# Altium project USB3.2_Hub_4Port.PrjPcb (part 2 of 2)

## Sheet Downstream_Ports_3-4.SchDoc: USB 3.2 Gen 1 4-Port Hub
size 431 x 279 mm; Author: Alberto Marrone; DrawnBy: Alberto Marrone; Engineer: Alberto Marrone; Revision: v1.0; SheetNumber: 7; SheetTotal: 7
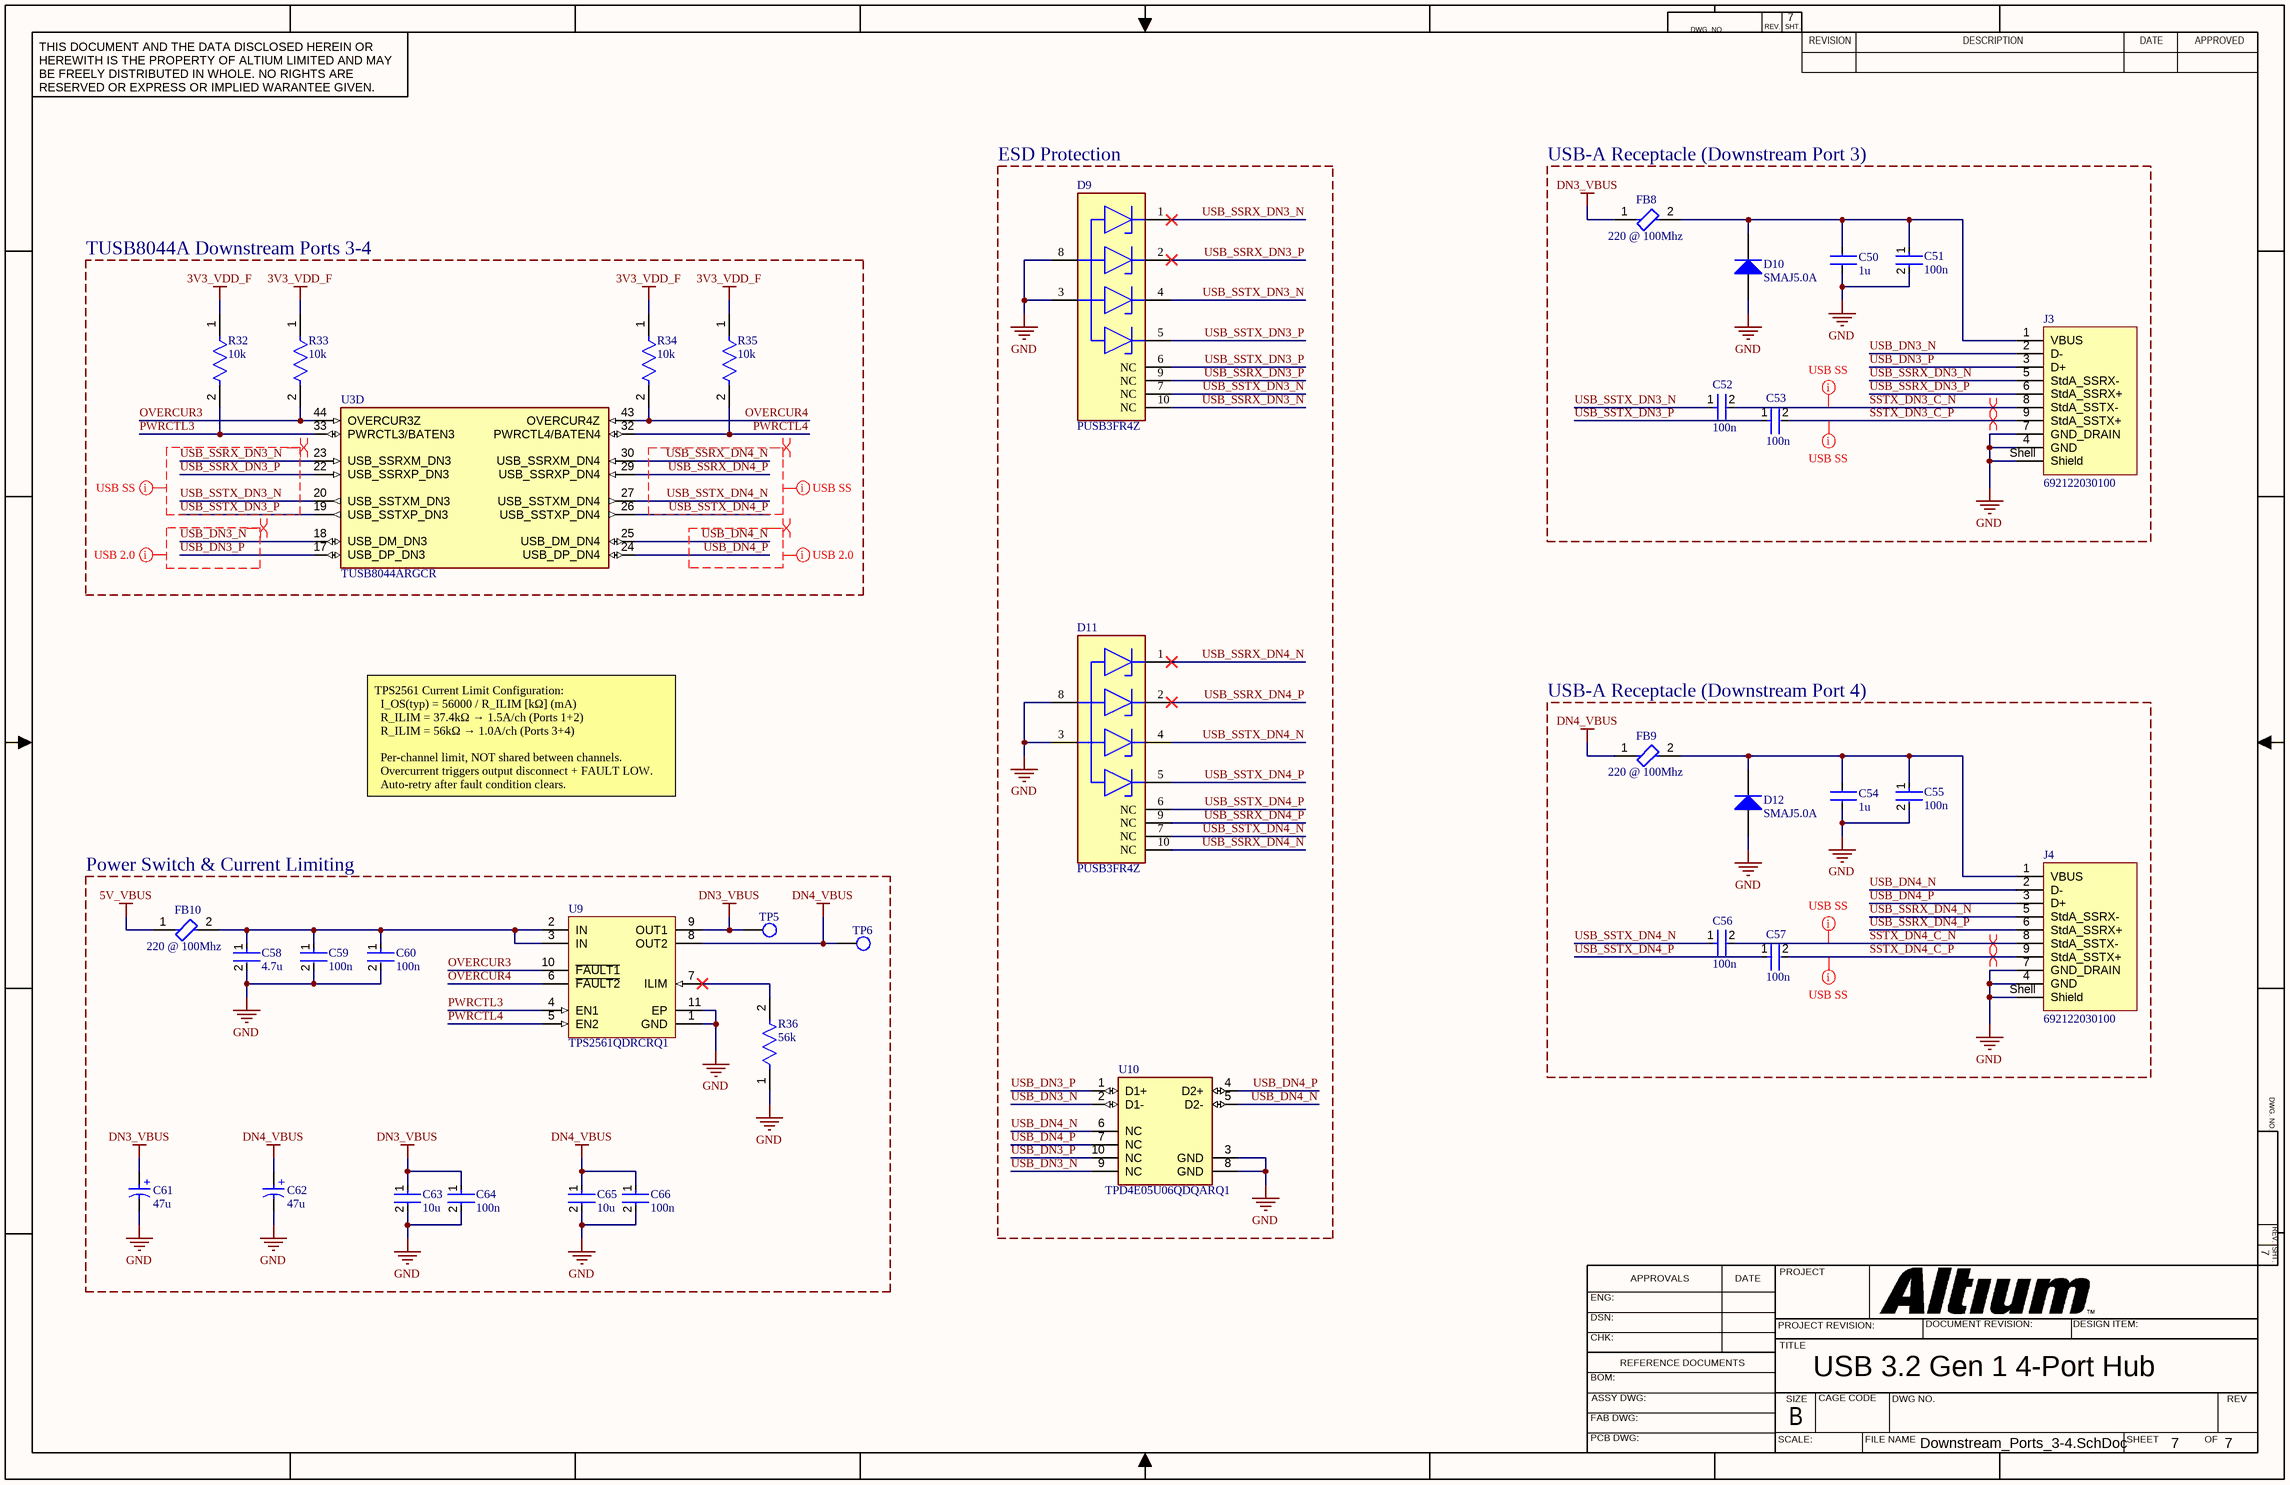
[diagram p5: Downstream_Ports_3-4.SchDoc]

### Parts
C50  1u  [CAPC1608X90N]
C51  100n  [FP-GRT155-0_05-IPC_C]
C52  100n  [FP-GRT155-0_05-IPC_C]
C53  100n  [FP-GRT155-0_05-IPC_C]
C54  1u  [CAPC1608X90N]
C55  100n  [FP-GRT155-0_05-IPC_C]
C56  100n  [FP-GRT155-0_05-IPC_C]
C57  100n  [FP-GRT155-0_05-IPC_C]
C58  4.7u  [FP-GRM21B-0_2-e0_2_0_7-IPC_A]
C59  100n  [FP-GRT155-0_05-IPC_C]
C60  100n  [FP-GRT155-0_05-IPC_C]
C61  47u  [WCAP-ASLL_D6.3H5.5]
C62  47u  [WCAP-ASLL_D6.3H5.5]
C63  10u  [FP-GRM21B-0_2-e0_2_0_7-IPC_B]
C64  100n  [FP-GRT155-0_05-IPC_C]
C65  10u  [FP-GRM21B-0_2-e0_2_0_7-IPC_B]
C66  100n  [FP-GRT155-0_05-IPC_C]
D9  PUSB3FR4Z  [FP-SOT1176-1-MFG]
D10  SMAJ5.0A  [BOUR-SMA-2_V]
D11  PUSB3FR4Z  [FP-SOT1176-1-MFG]
D12  SMAJ5.0A  [BOUR-SMA-2_V]
FB8  220 @ 100Mhz  [FP-BLM21-0_2-t0_85-e0_5-IPC_B]
FB9  220 @ 100Mhz  [FP-BLM21-0_2-t0_85-e0_5-IPC_B]
FB10  220 @ 100Mhz  [FP-BLM21-0_2-t0_85-e0_5-IPC_B]
J3  692122030100  [692122030100]
J4  692122030100  [692122030100]
R32  10k  [FP-AC0402-MFG]
R33  10k  [FP-AC0402-MFG]
R34  10k  [FP-AC0402-MFG]
R35  10k  [FP-AC0402-MFG]
R36  56k  [FP-AC0402-IPC_A]
TP5  Test_Point  [Test_Point]  (value not drawn)  (no BOM)
TP6  Test_Point  [Test_Point]  (value not drawn)  (no BOM)
U3  TUSB8044ARGCR  [QFN50P900X900X100-65N-D]  (part D of 6)
U9  TPS2561QDRCRQ1  [DRC0010A_V]
U10  TPD4E05U06QDQARQ1  [FP-DQA0010A-MFG]

### Blocks framed on the sheet
ESD Protection: D9 D11 U10
USB-A Receptacle (Downstream Port 3): C50-C53 D10 FB8 J3
TUSB8044A Downstream Ports 3-4: R32-R35 U3
USB-A Receptacle (Downstream Port 4): C54-C57 D12 FB9 J4
Power Switch & Current Limiting: C58-C66 FB10 R36 TP5 TP6 U9

### Nets
3V3_VDD_F: R32.1 R33.1 R34.1 R35.1
5V_VBUS: FB10.1
DN3_VBUS: C61.1(P) C63.1 C64.1 FB8.1 TP5.1 U9.9(OUT1)
DN4_VBUS: C62.1(P) C65.1 C66.1 FB9.1 TP6.1 U9.8(OUT2)
GND: C50.1 C51.2 C54.1 C55.2 C58.2 C59.2 C60.2 C61.2(N) C62.2(N) C63.2 C64.2 C65.2 C66.2 D9.3(GND) D9.8(GND) D10.1(A) D11.3(GND) D11.8(GND) D12.1(A) J3.4(GND) J3.7(GND_DRAIN) J3.Shell(Shield) J4.4(GND) J4.7(GND_DRAIN) J4.Shell(Shield) R36.1 U9.1(GND) U9.11(EP) U10.3(GND) U10.8(GND)
OVERCUR3: R33.2 U3.44(OVERCUR3Z) U9.10(~{FAULT1})
OVERCUR4: R34.2 U3.43(OVERCUR4Z) U9.6(~{FAULT2})
PWRCTL3: R32.2 U3.33(PWRCTL3/BATEN3) U9.4(EN1)
PWRCTL4: R35.2 U3.32(PWRCTL4/BATEN4) U9.5(EN2)
SSTX_DN3_C_N: C52.2 J3.8(StdA_SSTX-)
SSTX_DN3_C_P: C53.2 J3.9(StdA_SSTX+)
SSTX_DN4_C_N: C56.2 J4.8(StdA_SSTX-)
SSTX_DN4_C_P: C57.2 J4.9(StdA_SSTX+)
USB_DN3_N: J3.2(D-) U3.18(USB_DM_DN3) U10.2(D1-) U10.9(NC)
USB_DN3_P: J3.3(D+) U3.17(USB_DP_DN3) U10.1(D1+) U10.10(NC)
USB_DN4_N: J4.2(D-) U3.25(USB_DM_DN4) U10.5(D2-) U10.6(NC)
USB_DN4_P: J4.3(D+) U3.24(USB_DP_DN4) U10.4(D2+) U10.7(NC)
USB_SSRX_DN3_N: D9.1(CH1) D9.10(NC) J3.5(StdA_SSRX-) U3.23(USB_SSRXM_DN3)
USB_SSRX_DN3_P: D9.2(CH2) D9.9(NC) J3.6(StdA_SSRX+) U3.22(USB_SSRXP_DN3)
USB_SSRX_DN4_N: D11.1(CH1) D11.10(NC) J4.5(StdA_SSRX-) U3.30(USB_SSRXM_DN4)
USB_SSRX_DN4_P: D11.2(CH2) D11.9(NC) J4.6(StdA_SSRX+) U3.29(USB_SSRXP_DN4)
USB_SSTX_DN3_N: C52.1 D9.4(CH3) D9.7(NC) U3.20(USB_SSTXM_DN3)
USB_SSTX_DN3_P: C53.1 D9.5(CH4) D9.6(NC) U3.19(USB_SSTXP_DN3)
USB_SSTX_DN4_N: C56.1 D11.4(CH3) D11.7(NC) U3.27(USB_SSTXM_DN4)
USB_SSTX_DN4_P: C57.1 D11.5(CH4) D11.6(NC) U3.26(USB_SSTXP_DN4)
NetC50_2: C50.2 C51.1 D10.2(K) FB8.2 J3.1(VBUS)
NetC54_2: C54.2 C55.1 D12.2(K) FB9.2 J4.1(VBUS)
NetC58_1: C58.1 C59.1 C60.1 FB10.2 U9.2(IN) U9.3(IN)
NetR36_2: R36.2 U9.7(ILIM)

### Layout directives
differential pair: SSTX_DN3_C_N, SSTX_DN3_C_P, SSTX_DN4_C_N, SSTX_DN4_C_P, USB_DN3_N, USB_DN3_P, USB_DN4_N, USB_DN4_P, USB_SSRX_DN3_N, USB_SSRX_DN3_P, USB_SSRX_DN4_N, USB_SSRX_DN4_P, USB_SSTX_DN3_N, USB_SSTX_DN3_P, USB_SSTX_DN4_N, USB_SSTX_DN4_P
net class USB_SuperSpeed: SSTX_DN3_C_N, SSTX_DN3_C_P, SSTX_DN4_C_N, SSTX_DN4_C_P, USB_SSRX_DN3_N, USB_SSRX_DN3_P, USB_SSRX_DN4_N, USB_SSRX_DN4_P, USB_SSTX_DN3_N, USB_SSTX_DN3_P, USB_SSTX_DN4_N, USB_SSTX_DN4_P
net class USB_HighSpeed: USB_DN3_N, USB_DN3_P, USB_DN4_N, USB_DN4_P

### Notes on the sheet
- TPS2561 Current Limit Configuration:
  I_OS(typ) = 56000 / R_ILIM [kΩ] (mA)
  R_ILIM = 37.4kΩ → 1.5A/ch (Ports 1+2)
  R_ILIM = 56kΩ → 1.0A/ch (Ports 3+4)
  Per-channel limit, NOT shared between channels.
  Overcurrent triggers output disconnect + FAULT LOW.
  Auto-retry after fault condition clears.
- DWG. NO.
- REV.
- SHT.
- THIS DOCUMENT AND THE DATA DISCLOSED HEREIN OR HEREWITH IS THE PROPERTY OF ALTIUM LIMITED AND MAY BE FREELY DISTRIBUTED IN WHOLE. NO RIGHTS ARE RESERVED OR EXPRESS OR IMPLIED WARANTEE GIVEN.
- REVISION
- DESCRIPTION
- DATE
- APPROVED
- ENG:
- APPROVALS
- PROJECT
- DSN:
- CHK:
- REFERENCE DOCUMENTS
- PROJECT REVISION:
- TITLE
- DOCUMENT REVISION:
- DESIGN ITEM:
- BOM:
- FAB DWG:
- PCB DWG:
- ASSY DWG:
- SCALE:
- SIZE
- B
- CAGE CODE
- FILE NAME
- DWG NO.
- SHEET
- OF
- REV
- (in symbol CMP-03913-53914523-3) +

### Library data of the parts
C50 C54 = C1608X7R1H105K080AB: The superior mechanical strength and reliability due to the monolithic structure.  Low ESR, ESL and excellent frequency characteristics allow for a circuit design that closely conforms to theoretical values.  Low self-heating and high ripple resistance due to low ESR.  No polarity; Manufacturer_Name: TDK; Geometry.Height: 0.9mm; Mouser Part Number: 810-C1608X7R1H105K08; Mouser Price/Stock: https://www.mouser.co.uk/ProductDetail/TDK/C1608X7R1H105K080AB?qs=efUn273yAhdzCWVW9RXgig%3D%3D; Manufacturer_Part_Number: C1608X7R1H105K080AB; Datasheet Link: https://media.digikey.com/pdf/Data%20Sheets/TDK%20PDFs/mlcc_commercial_general_Rev2018.pdf
C51-C53 C55-C57 C59 C60 C64 C66 = CMP-06035-030480-1: Multi-Layer Ceramic Capacitor 100nF 50V X7R ±10% 0402 Paper T/R
C58 = CMP-06035-048385-1: Chip Multilayer Ceramic Capacitors for General Purpose, 0805, 4.7uF, X7R, 15%, 10%, 35V
C61 C62 = CMP-03913-53914523-3: Alum. Electrolytic Cap 47UF 35V 5.5MMV-CHIP Wcap-asll, Lifetime 2000H +105OC; Insulation Resistance: 2.12766MΩ; Capacitance: 47µF; Life (Hours): 2000hours; Material: Aluminium; ESR (Equivalent Series Resistance): 416.365mΩ; Leakage Current: 16.45µA; Ripple Current (AC): 240mA; Tolerance: 20%; Impedance: 440mΩ; Min Operating Temperature: -55°C; Length: 5.5mm; Voltage Rating (DC): 35V; REACH SVHC: Unknown; Height: 5.5mm; Max Operating Temperature: 105°C; Diameter: 6.3mm; Voltage Rating: 35V; Case/Package: Radial; Packaging: Cut Tape; Ripple Current: 240mA
C63 C65 = CMP-06035-047417-1: Chip Multilayer Ceramic Capacitors for General Purpose, 0805, 10uF, X7R, 15%, 10%, 25V
D9 D11 = CMP-14432-000005-1: TVS DIODE 3.3VWM 3VC DFN2510A-10; RoHS Compliant: Yes
D10 D12 = CMP-2000-07090-1: SMAJ Transient Voltage Suppressor Diode Series, 3.5 V, -55 to 150 degC, 2-Pin SMA, RoHS, Tape and Reel; Manufacturer: Bourns; EDA / CAD Models: DownloadfromAcceleratedDesigns; Unidirectional Channels: 1; Voltage - Breakdown (Min): 6.4V; Voltage - Reverse Standoff (Typ): 5V; Voltage - Clamping (Max) @ Ipp: 9.2V; Other Names: SMAJ5.0ABDKR; Type: Zener; Catalog Drawings: SMAJSeriesFootprintSMAJ,SMBJSeries; Featured Product: SMAJ/SMBJ/SMCJ/SMLJDiscreteTVSDiodes; Power - Peak Pulse: 400W; Current - Peak Pulse (10/1000µs): 43.5A; Power Line Protection: No; Online Catalog: SMAJSeries; Supplier Device Package: SMA(DO-214AC); Operating Temperature: -55°C~150°C(TJ); Package Description: 2-Pin Surface Mount Device, Body 4.315 x 2.605 mm; Datasheet URL: https://datasheet.ciiva.com/25624/0900766b8112213b-25624680.pdf; Manufacturer URL: http://www.bourns.com/; Datasheet Version: 08/2012; Series: SMAJ; Family: TVS-Diodes; Bidirectional Channels: -; Applications: GeneralPurpose; Package Reference: SMA-2; Standard Package: 1; Package / Case: DO-214AC,SMA; Category: CircuitProtection; RoHS Information: SMAJSeriesMaterialDeclaration; Mounting Technology: SurfaceMount; Capacitance @ Frequency: -; Packaging: Digi-Reel®; Mounting Type: SurfaceMount
FB8-FB10 = CMP-0686-00610-3: Chip Ferrite Bead, 0805, 220Ω @ 100MHz, 0.045Ω, 25%, 2A; Number of Circuits: 1; Shielding: Unshielded; DC Resistance (DCR): 45mR; Impedance: 220R; Radiation Hardening: No; Material: Ferrite; Frequency: 100MHz; Width: 1.25mm; DC Current: 2A; Max DC Current: 2A; Number of Lines: 1; Package Quantity: 1; Case Code (Metric): 2012; Current Rating: 2A; Case/Package: 0805; Current: 2A; Military Standard: Not; Core Material: Ferrite; Depth: 1.25mm; Contact Plating: Tin; DC Resistance-Max: 45mR; Max Operating Temperature: 125°C; Length: 2mm; Max Current Rating: 2A; REACH SVHC: No SVHC; Termination: SMD/SMT; Min Operating Temperature: -55°C; Series: BLM21P; Test Frequency: 100MHz; Tolerance: 25%; Number of Pins: 2; RoHS Compliant: Yes; Height: 0.85mm; Packaging: Tape and Reel; Lead Free: Lead Free; Case Code (Imperial): 0805
J3 J4 = CMP-1502-03220-3: Conn USB 3.0 Type A RCP 9 POS 1.25mm Solder RA SMD 9 Terminal 1 Port T/R; Current Rating: 250mA; Insulation Resistance: 100MΩ; Number of Contacts: 9; Number of Ports: 1; Voltage Rating (AC): 30V; USB Standard: USB 3.0; Gender: Receptacle; Contact Resistance: 50mΩ; RoHS: Compliant; Min Operating Temperature: -20°C; Packaging: Tape and Reel; Width: 16.66mm; Contact Plating: Gold; Color: Blue; Height: 8.01mm; Mount: Horizontal, Surface Mount, Through Hole; Voltage Rating: 30V; Contact Material: Gold, Nickel; Connector Type: USB; REACH SVHC: Unknown; Number of Pins: 9; Max Operating Temperature: 85°C; Operating Supply Voltage: 30V; Lead Free: Lead Free; Termination: SMD/SMT; Orientation: Horizontal; Flammability Rating: UL94 V-0; Features: Shielded; Length: 15.1mm
R32-R35 = CMP-2002-01790-3: RES 10kΩ ±1% 0.063W 0402; Power Rating: 62.5mW; Voltage Rating: 50V; Temperature Coefficient: 100ppm/°C; Resistance: 10kR; Max Power Dissipation: 63mW; Tolerance: 1%; Military Standard: Not; Construction: Rectangular; Termination: SMD/SMT; Max Operating Temperature: 155°C; Min Operating Temperature: -55°C; Height: 0.015inch; Lead Free: Lead Free; Width: 0.02inch; Case/Package: 0402; Resistor Type: Thick Film; Series: AC; Features: Moisture Resistant; RoHS Compliant: Yes; Number of Terminations: 2; Case Code (Metric): 1005; Length: 0.039inch; Depth: 0.5mm; Size Code: 0402; Packaging: Tape and Reel; Case Code (Imperial): 0402
R36 = CMP-2002-01828-3: RES 56kΩ ±1% 0.063W 0402; Max Power Dissipation: 63mW; Temperature Coefficient: 100ppm/°C; Resistance: 56kR; Lead Free: Lead Free; Max Operating Temperature: 155°C; Series: AC; Case Code (Imperial): 0402; RoHS Compliant: Yes; Case/Package: 0402; Power Rating: 63mW; Height: 0.015inch; Tolerance: 1%; Features: Moisture Resistant; Size Code: 0402; Min Operating Temperature: -55°C; Resistor Type: Thick Film; Case Code (Metric): 1005; Length: 0.039inch; Number of Terminations: 2; Width: 0.02inch; Packaging: Cut Tape
U3 = TUSB8044ARGCR: Four-port USB 3.2 x1 Gen1 hub with USB billboard; Manufacturer_Name: Texas Instruments; Geometry.Height: 1mm; Mouser Part Number: 595-TUSB8044ARGCR; Mouser Price/Stock: https://www.mouser.co.uk/ProductDetail/Texas-Instruments/TUSB8044ARGCR?qs=9r4v7xj2LnlTBCFutY1Bfg%3D%3D; Manufacturer_Part_Number: TUSB8044ARGCR; Datasheet Link: http://www.ti.com/lit/gpn/TUSB8044A
U9 = CMP-0337-00206-2: Automotive Catalog Dual Channel Precision Adjustable Current-Limited Power Switch, 0.25 to 2.5 A Current Limit, -40 to 125 degC, 10-pin SON (DRC), Green (RoHS & no Sb/Br); Manufacturer: Texas Instruments; rDS(on) per FET(Typ)(mOhms): 45; Current Limit(A): 0.25 - 2.5; Current Limit Accuracy @ 1A: +/-7.5% (2590mA min / 3005mA max); Vin(Min)(V): 2.5; Number of Switches: 2; Vin(Max)(V): 6.5; Current Limit Topology: Constant-Current; Enable: Active High; DatasheetVersion: SLVSB51A; Eco-Plan: Green (RoHS & no Sb/Br); PartNumber: TPS2561QDRCRQ1; PackageReference: DRC0010A; Rating: Automotive; PackageDescription: 10-Pin Plastic Small Outline No-Lead, 3 x 3 x 1 mm Body, 0.5 mm Pitch, Exposed Pad; Continuous Current(Max)(A): 2.5; Mounting Technology: Surface Mount; PackageVersion: revL, Sep-2011; ComponentLink1Description: Datasheet; ComponentLink1URL: http://www.ti.com/general/docs/lit/getliterature.tsp?genericPartNumber=TPS2561-Q1&fileType=pdf
U10 = CMP-04985-000004-1: TVS DIODE 5.5V 14V 10USON; Manufacturer: Texas Instruments; Direction: Unidirectional; Standoff Height: 0mm; Capacitance: 0.5pF; Number Of Channels: 4; Breakdown Voltage: 6.4V; Peak Pulse Power: 2.5W; Automotive Grade: Grade 1; Value: 0.5pF; Interface: USB,Ethernet,LVDS,Other; Peak Pulse Current: 2.5A; Operating Supply Voltage: 5.5V; Reverse Standoff Voltage: 5.5V; Package: DQA0010A; Temperature Range Low: -40°C; Temperature Range High: +125°C; Ambient Temperature Range Low: -40°C; Device Class L1: Circuit Protection; Clamping Voltage: 14V; Manufacturer Part Number: TPD4E05U06QDQARQ1; Device Class L2: ESD and Circuit Protection ICs; Octopart: https://octopart.com/tpd4e05u06qdqarq1-texas+instruments-48523459; Device Class L3: unset; Height: 0.55mm; Automotive: Yes; ComponentLink2Description: Datasheet; RoHS: TRUE; Ambient Temperature Range High: +125°C; Category: IC; Mouser Description: Automotive 4-Channel ESD Protection Solution for SuperSpeed (up to 5 Gbps) Interface 10-USON -40 to 125; Temperature: -40°C to +125°C; ComponentLink2URL: http://www.ti.com/lit/ds/symlink/tpd4e05u06-q1.pdf; Digikey Description: TVS DIODE 5.5V 14V 10USON; Lead Free: Yes

## Sheet Downstream_Port_2.SchDoc: USB 3.2 Gen 1 4-Port Hub
size 431 x 279 mm; Author: Alberto Marrone; DrawnBy: Alberto Marrone; Engineer: Alberto Marrone; Revision: v1.0; SheetNumber: 6; SheetTotal: 7
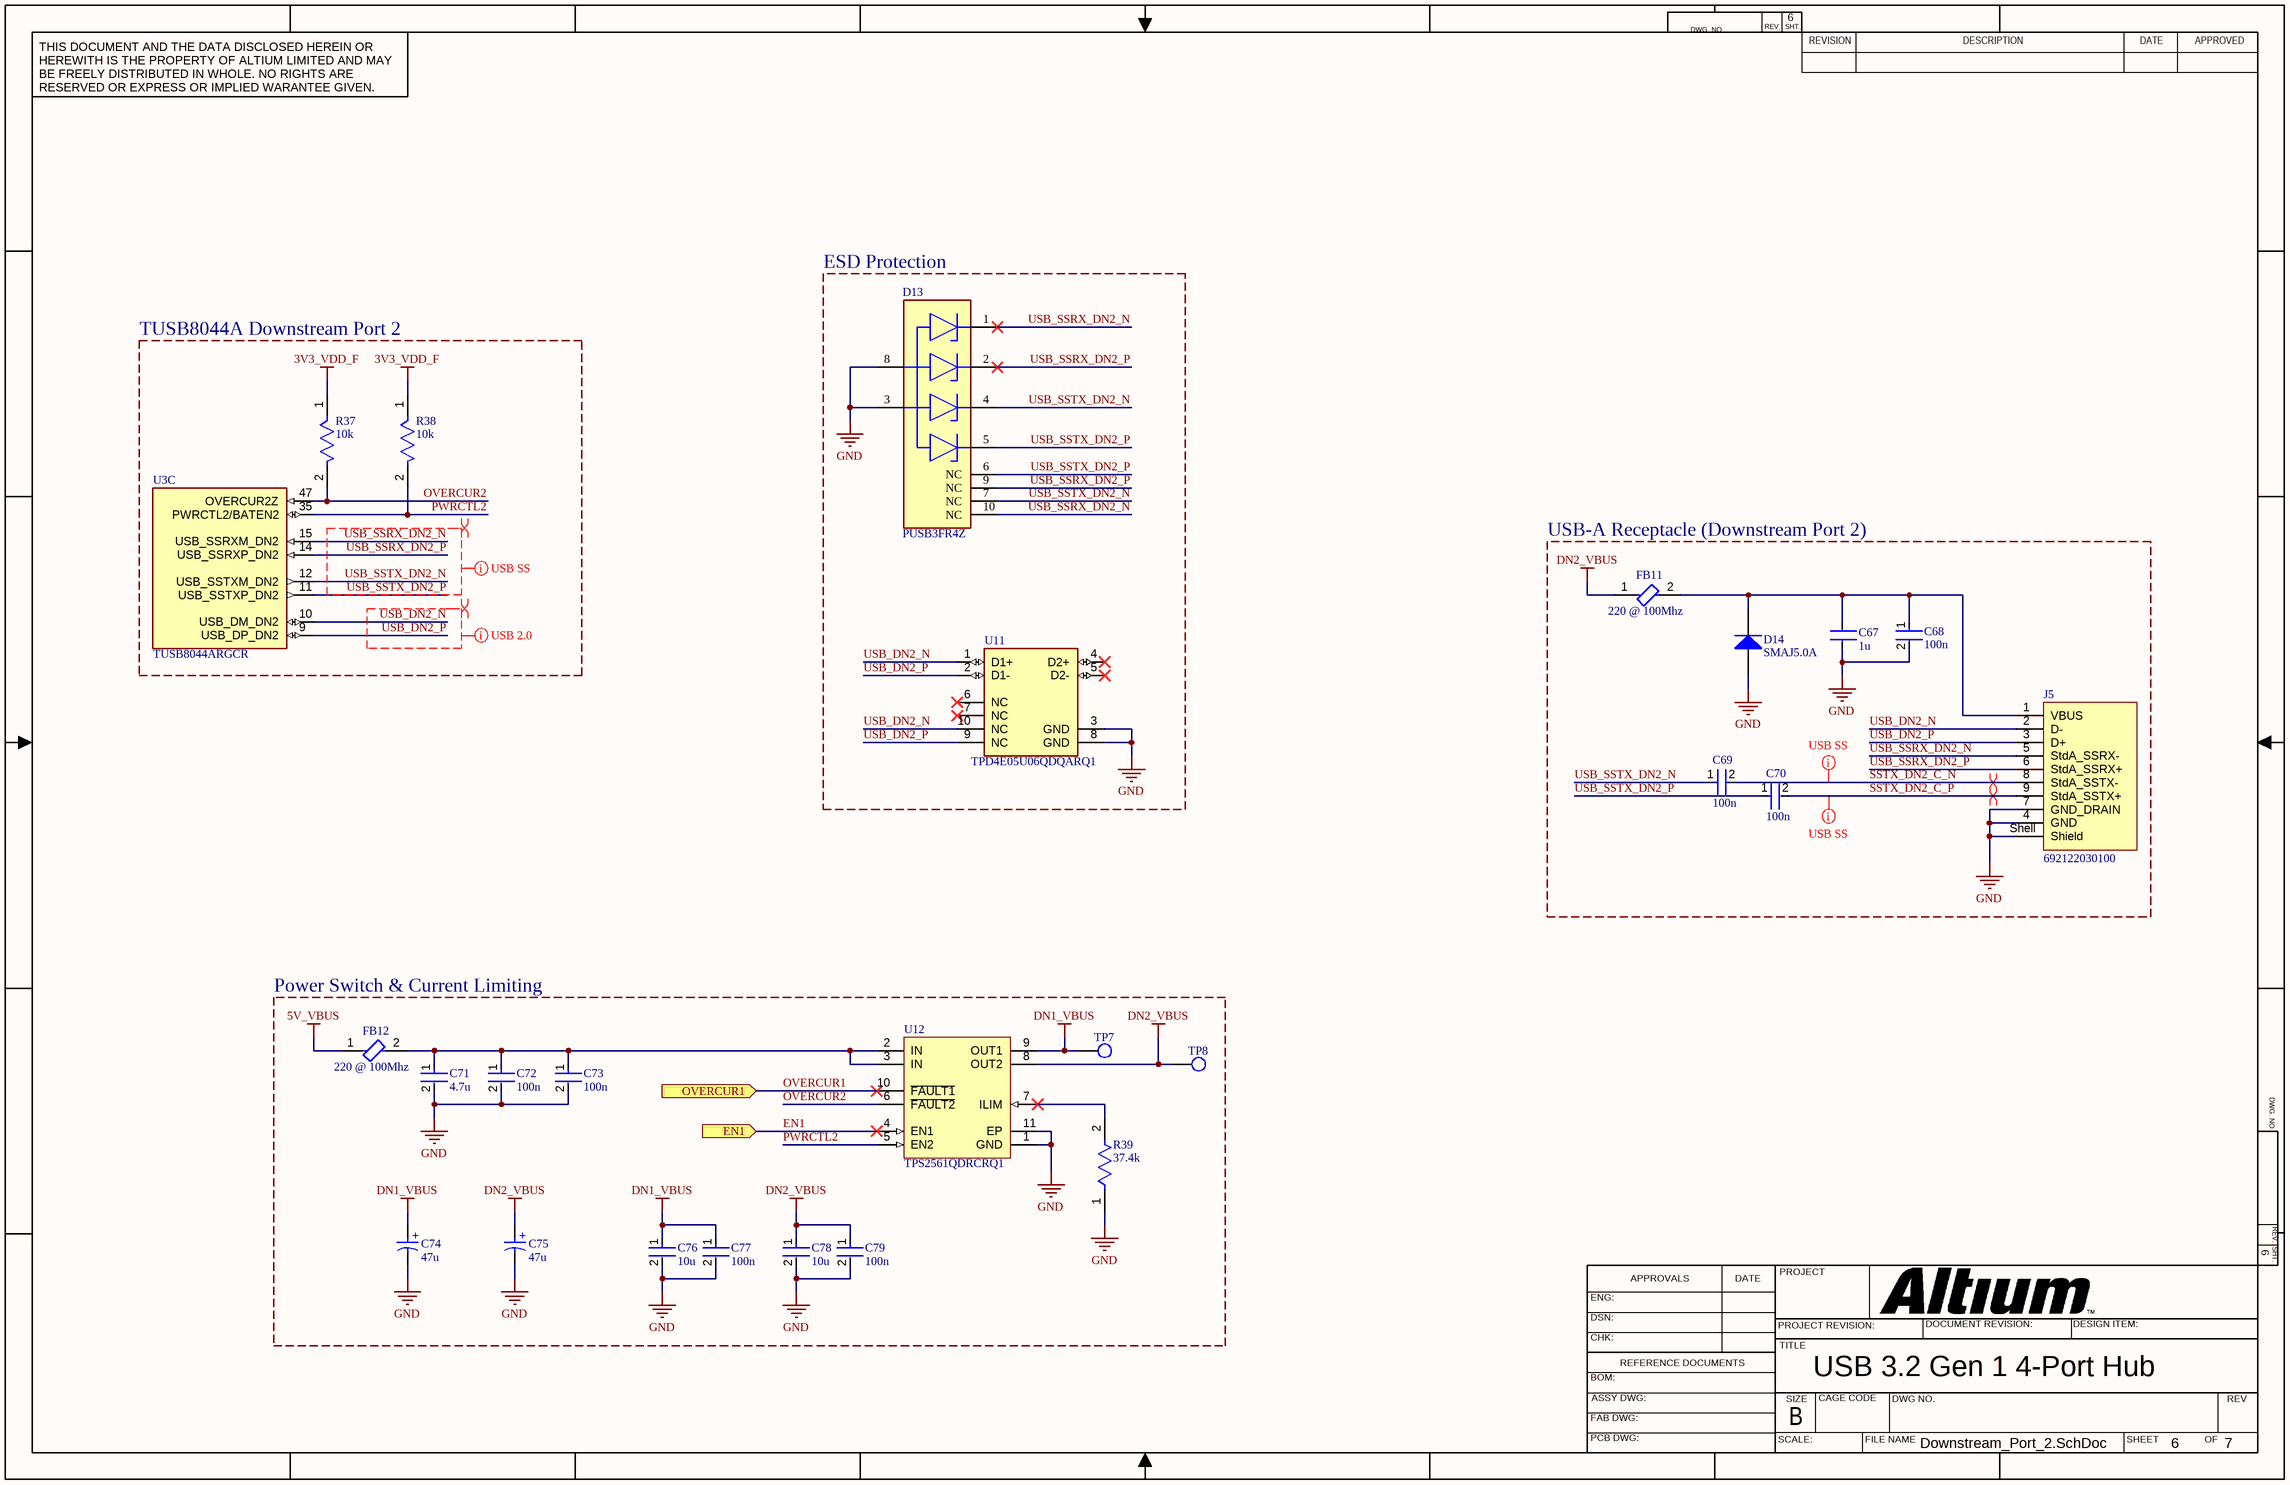
[diagram p6: Downstream_Port_2.SchDoc]

### Parts
C67  1u  [CAPC1608X90N]
C68  100n  [FP-GRT155-0_05-IPC_C]
C69  100n  [FP-GRT155-0_05-IPC_C]
C70  100n  [FP-GRT155-0_05-IPC_C]
C71  4.7u  [FP-GRM21B-0_2-e0_2_0_7-IPC_A]
C72  100n  [FP-GRT155-0_05-IPC_C]
C73  100n  [FP-GRT155-0_05-IPC_C]
C74  47u  [WCAP-ASLL_D6.3H5.5]
C75  47u  [WCAP-ASLL_D6.3H5.5]
C76  10u  [FP-GRM21B-0_2-e0_2_0_7-IPC_B]
C77  100n  [FP-GRT155-0_05-IPC_C]
C78  10u  [FP-GRM21B-0_2-e0_2_0_7-IPC_B]
C79  100n  [FP-GRT155-0_05-IPC_C]
D13  PUSB3FR4Z  [FP-SOT1176-1-MFG]
D14  SMAJ5.0A  [BOUR-SMA-2_V]
FB11  220 @ 100Mhz  [FP-BLM21-0_2-t0_85-e0_5-IPC_B]
FB12  220 @ 100Mhz  [FP-BLM21-0_2-t0_85-e0_5-IPC_B]
J5  692122030100  [692122030100]
R37  10k  [FP-AC0402-MFG]
R38  10k  [FP-AC0402-MFG]
R39  37.4k  [FP-AC0402-IPC_B]
TP7  Test_Point  [Test_Point]  (value not drawn)  (no BOM)
TP8  Test_Point  [Test_Point]  (value not drawn)  (no BOM)
U3  TUSB8044ARGCR  [QFN50P900X900X100-65N-D]  (part C of 6)
U11  TPD4E05U06QDQARQ1  [FP-DQA0010A-MFG]
U12  TPS2561QDRCRQ1  [DRC0010A_V]

### Blocks framed on the sheet
ESD Protection: D13 U11
TUSB8044A Downstream Port 2: R37 R38 U3
USB-A Receptacle (Downstream Port 2): C67-C70 D14 FB11 J5
Power Switch & Current Limiting: C71-C79 FB12 R39 TP7 TP8 U12

### Ports
EN1 (in, see Top_Level[4D], Downstream_Port_1[5B]), OVERCUR1 (in, see Top_Level[3D], Downstream_Port_1[7B])

### Nets
3V3_VDD_F: R37.1 R38.1
5V_VBUS: FB12.1
DN1_VBUS: C74.1(P) C76.1 C77.1 TP7.1 U12.9(OUT1)
DN2_VBUS: C75.1(P) C78.1 C79.1 FB11.1 TP8.1 U12.8(OUT2)
GND: C67.1 C68.2 C71.2 C72.2 C73.2 C74.2(N) C75.2(N) C76.2 C77.2 C78.2 C79.2 D13.3(GND) D13.8(GND) D14.1(A) J5.4(GND) J5.7(GND_DRAIN) J5.Shell(Shield) R39.1 U11.3(GND) U11.8(GND) U12.1(GND) U12.11(EP)
EN1: U12.4(EN1) ; port EN1
OVERCUR1: U12.10(~{FAULT1}) ; port OVERCUR1
OVERCUR2: R37.2 U3.47(OVERCUR2Z) U12.6(~{FAULT2})
PWRCTL2: R38.2 U3.35(PWRCTL2/BATEN2) U12.5(EN2)
SSTX_DN2_C_N: C69.2 J5.8(StdA_SSTX-)
SSTX_DN2_C_P: C70.2 J5.9(StdA_SSTX+)
USB_DN2_N: J5.2(D-) U3.10(USB_DM_DN2) U11.1(D1+) U11.10(NC)
USB_DN2_P: J5.3(D+) U3.9(USB_DP_DN2) U11.2(D1-) U11.9(NC)
USB_SSRX_DN2_N: D13.1(CH1) D13.10(NC) J5.5(StdA_SSRX-) U3.15(USB_SSRXM_DN2)
USB_SSRX_DN2_P: D13.2(CH2) D13.9(NC) J5.6(StdA_SSRX+) U3.14(USB_SSRXP_DN2)
USB_SSTX_DN2_N: C69.1 D13.4(CH3) D13.7(NC) U3.12(USB_SSTXM_DN2)
USB_SSTX_DN2_P: C70.1 D13.5(CH4) D13.6(NC) U3.11(USB_SSTXP_DN2)
NetC67_2: C67.2 C68.1 D14.2(K) FB11.2 J5.1(VBUS)
NetC71_1: C71.1 C72.1 C73.1 FB12.2 U12.2(IN) U12.3(IN)
NetR39_2: R39.2 U12.7(ILIM)

Not connected (* = marked no-connect by the designer): U11 4(D2+)* 5(D2-)* 6(NC)* 7(NC)*

### Layout directives
differential pair: SSTX_DN2_C_N, SSTX_DN2_C_P, USB_DN2_N, USB_DN2_P, USB_SSRX_DN2_N, USB_SSRX_DN2_P, USB_SSTX_DN2_N, USB_SSTX_DN2_P
net class USB_SuperSpeed: SSTX_DN2_C_N, SSTX_DN2_C_P, USB_SSRX_DN2_N, USB_SSRX_DN2_P, USB_SSTX_DN2_N, USB_SSTX_DN2_P
net class USB_HighSpeed: USB_DN2_N, USB_DN2_P

### Notes on the sheet
- DWG. NO.
- REV.
- SHT.
- THIS DOCUMENT AND THE DATA DISCLOSED HEREIN OR HEREWITH IS THE PROPERTY OF ALTIUM LIMITED AND MAY BE FREELY DISTRIBUTED IN WHOLE. NO RIGHTS ARE RESERVED OR EXPRESS OR IMPLIED WARANTEE GIVEN.
- REVISION
- DESCRIPTION
- DATE
- APPROVED
- ENG:
- APPROVALS
- PROJECT
- DSN:
- CHK:
- REFERENCE DOCUMENTS
- PROJECT REVISION:
- TITLE
- DOCUMENT REVISION:
- DESIGN ITEM:
- BOM:
- FAB DWG:
- PCB DWG:
- ASSY DWG:
- SCALE:
- SIZE
- B
- CAGE CODE
- FILE NAME
- DWG NO.
- SHEET
- OF
- REV
- (in symbol CMP-03913-53914523-3) +

### Library data of the parts
C67 = C1608X7R1H105K080AB: as C50 on sheet Downstream_Ports_3-4; Mouser Part Number: 810-C1608X7R1H105K08; Mouser Price/Stock: https://www.mouser.co.uk/ProductDetail/TDK/C1608X7R1H105K080AB?qs=efUn273yAhdzCWVW9RXgig%3D%3D; Manufacturer_Part_Number: C1608X7R1H105K080AB; Datasheet Link: https://media.digikey.com/pdf/Data%20Sheets/TDK%20PDFs/mlcc_commercial_general_Rev2018.pdf
C68-C70 C72 C73 C77 C79 = CMP-06035-030480-1: as C51 on sheet Downstream_Ports_3-4
C71 = CMP-06035-048385-1: as C58 on sheet Downstream_Ports_3-4
C74 C75 = CMP-03913-53914523-3: as C61 on sheet Downstream_Ports_3-4; Min Operating Temperature: -55°C; Length: 5.5mm; Voltage Rating (DC): 35V; REACH SVHC: Unknown; Height: 5.5mm; Max Operating Temperature: 105°C; Diameter: 6.3mm; Voltage Rating: 35V; Case/Package: Radial; Packaging: Cut Tape; Ripple Current: 240mA
C76 C78 = CMP-06035-047417-1: as C63 on sheet Downstream_Ports_3-4
D13 = CMP-14432-000005-1: TVS DIODE 3.3VWM 3VC DFN2510A-10; RoHS Compliant: Yes
D14 = CMP-2000-07090-1: as D10 on sheet Downstream_Ports_3-4; Supplier Device Package: SMA(DO-214AC); Operating Temperature: -55°C~150°C(TJ); Package Description: 2-Pin Surface Mount Device, Body 4.315 x 2.605 mm; Datasheet URL: https://datasheet.ciiva.com/25624/0900766b8112213b-25624680.pdf; Manufacturer URL: http://www.bourns.com/; Datasheet Version: 08/2012; Series: SMAJ; Family: TVS-Diodes; Bidirectional Channels: -; Applications: GeneralPurpose; Package Reference: SMA-2; Standard Package: 1; Package / Case: DO-214AC,SMA; Category: CircuitProtection; RoHS Information: SMAJSeriesMaterialDeclaration; Mounting Technology: SurfaceMount; Capacitance @ Frequency: -; Packaging: Digi-Reel®; Mounting Type: SurfaceMount
FB11 FB12 = CMP-0686-00610-3: as FB8 on sheet Downstream_Ports_3-4; Radiation Hardening: No; Material: Ferrite; Frequency: 100MHz; Width: 1.25mm; DC Current: 2A; Max DC Current: 2A; Number of Lines: 1; Package Quantity: 1; Case Code (Metric): 2012; Current Rating: 2A; Case/Package: 0805; Current: 2A; Military Standard: Not; Core Material: Ferrite; Depth: 1.25mm; Contact Plating: Tin; DC Resistance-Max: 45mR; Max Operating Temperature: 125°C; Length: 2mm; Max Current Rating: 2A; REACH SVHC: No SVHC; Termination: SMD/SMT; Min Operating Temperature: -55°C; Series: BLM21P; Test Frequency: 100MHz; Tolerance: 25%; Number of Pins: 2; RoHS Compliant: Yes; Height: 0.85mm; Packaging: Tape and Reel; Lead Free: Lead Free; Case Code (Imperial): 0805
J5 = CMP-1502-03220-3: as J3 on sheet Downstream_Ports_3-4; RoHS: Compliant; Min Operating Temperature: -20°C; Packaging: Tape and Reel; Width: 16.66mm; Contact Plating: Gold; Color: Blue; Height: 8.01mm; Mount: Horizontal, Surface Mount, Through Hole; Voltage Rating: 30V; Contact Material: Gold, Nickel; Connector Type: USB; REACH SVHC: Unknown; Number of Pins: 9; Max Operating Temperature: 85°C; Operating Supply Voltage: 30V; Lead Free: Lead Free; Termination: SMD/SMT; Orientation: Horizontal; Flammability Rating: UL94 V-0; Features: Shielded; Length: 15.1mm
R37 R38 = CMP-2002-01790-3: as R32 on sheet Downstream_Ports_3-4; Tolerance: 1%; Military Standard: Not; Construction: Rectangular; Termination: SMD/SMT; Max Operating Temperature: 155°C; Min Operating Temperature: -55°C; Height: 0.015inch; Lead Free: Lead Free; Width: 0.02inch; Case/Package: 0402; Resistor Type: Thick Film; Series: AC; Features: Moisture Resistant; RoHS Compliant: Yes; Number of Terminations: 2; Case Code (Metric): 1005; Length: 0.039inch; Depth: 0.5mm; Size Code: 0402; Packaging: Tape and Reel; Case Code (Imperial): 0402
R39 = CMP-03412-003373-2: RES 37.4kΩ ±1% 0.063W 0402; Temperature Coefficient: 100ppm/°C; Voltage Rating: 50V; Resistance: 37.4kR; Max Power Dissipation: 63mW; Power Rating: 62.5mW; Width: 0.5mm; Tolerance: 1%; Length: 0.039inch; Number of Terminations: 2; Features: Moisture Resistant; Min Operating Temperature: -55°C; Case Code (Metric): 1005; Series: AC; RoHS Compliant: Yes; Resistor Type: Thick Film; Termination: SMD/SMT; Case/Package: 0402; Packaging: Tape and Reel; Case Code (Imperial): 0402; Height: 0.015inch; Max Operating Temperature: 155°C
U3 = TUSB8044ARGCR: as U3 on sheet Downstream_Ports_3-4; Mouser Part Number: 595-TUSB8044ARGCR; Mouser Price/Stock: https://www.mouser.co.uk/ProductDetail/Texas-Instruments/TUSB8044ARGCR?qs=9r4v7xj2LnlTBCFutY1Bfg%3D%3D; Manufacturer_Part_Number: TUSB8044ARGCR; Datasheet Link: http://www.ti.com/lit/gpn/TUSB8044A
U11 = CMP-04985-000004-1: as U10 on sheet Downstream_Ports_3-4; Operating Supply Voltage: 5.5V; Reverse Standoff Voltage: 5.5V; Package: DQA0010A; Temperature Range Low: -40°C; Temperature Range High: +125°C; Ambient Temperature Range Low: -40°C; Device Class L1: Circuit Protection; Clamping Voltage: 14V; Manufacturer Part Number: TPD4E05U06QDQARQ1; Device Class L2: ESD and Circuit Protection ICs; Octopart: https://octopart.com/tpd4e05u06qdqarq1-texas+instruments-48523459; Device Class L3: unset; Height: 0.55mm; Automotive: Yes; ComponentLink2Description: Datasheet; RoHS: TRUE; Ambient Temperature Range High: +125°C; Category: IC; Mouser Description: Automotive 4-Channel ESD Protection Solution for SuperSpeed (up to 5 Gbps) Interface 10-USON -40 to 125; Temperature: -40°C to +125°C; ComponentLink2URL: http://www.ti.com/lit/ds/symlink/tpd4e05u06-q1.pdf; Digikey Description: TVS DIODE 5.5V 14V 10USON; Lead Free: Yes
U12 = CMP-0337-00206-2: as U9 on sheet Downstream_Ports_3-4; DatasheetVersion: SLVSB51A; Eco-Plan: Green (RoHS & no Sb/Br); PartNumber: TPS2561QDRCRQ1; PackageReference: DRC0010A; Rating: Automotive; PackageDescription: 10-Pin Plastic Small Outline No-Lead, 3 x 3 x 1 mm Body, 0.5 mm Pitch, Exposed Pad; Continuous Current(Max)(A): 2.5; Mounting Technology: Surface Mount; PackageVersion: revL, Sep-2011; ComponentLink1Description: Datasheet; ComponentLink1URL: http://www.ti.com/general/docs/lit/getliterature.tsp?genericPartNumber=TPS2561-Q1&fileType=pdf

## Nets that join several sheets
3V3_VDD: Upstream (FB3.1 R11.2), Power (19 pins), Downstream_Port_1 (FB5.1 R24.2)
3V3_VDD_F: Power (10 pins), Hub_Core (7 pins), Downstream_Port_1 (R28.1 R29.1), Downstream_Ports_3-4 (R32.1 R33.1 R34.1 R35.1), Downstream_Port_2 (R37.1 R38.1)
5V_VBUS: Upstream (9 pins), Power (6 pins), Downstream_Port_1 (FB6.1), Downstream_Ports_3-4 (FB10.1), Downstream_Port_2 (FB12.1)
DN1_VBUS: Downstream_Port_1 (FB7.1 R26.1), Downstream_Port_2 (5 pins)
GND: Upstream (27 pins), Power (44 pins), Hub_Core (10 pins), Downstream_Port_1 (27 pins), Downstream_Ports_3-4 (30 pins), Downstream_Port_2 (22 pins)
EN1: Downstream_Port_1 (Q1.3 R31.2), Downstream_Port_2 (U12.4)
GRSTz: Power (C27.1 R6.1 U2.9), Hub_Core (TP4.1 U3.50)
OVERCUR1: Downstream_Port_1 (R28.2 U3.46), Downstream_Port_2 (U12.10)

## Assembly variants
USB3.2_Hub_4Port WP Disabled: not fitted R22